# Altium project UP24CI01v5.PrjPcb
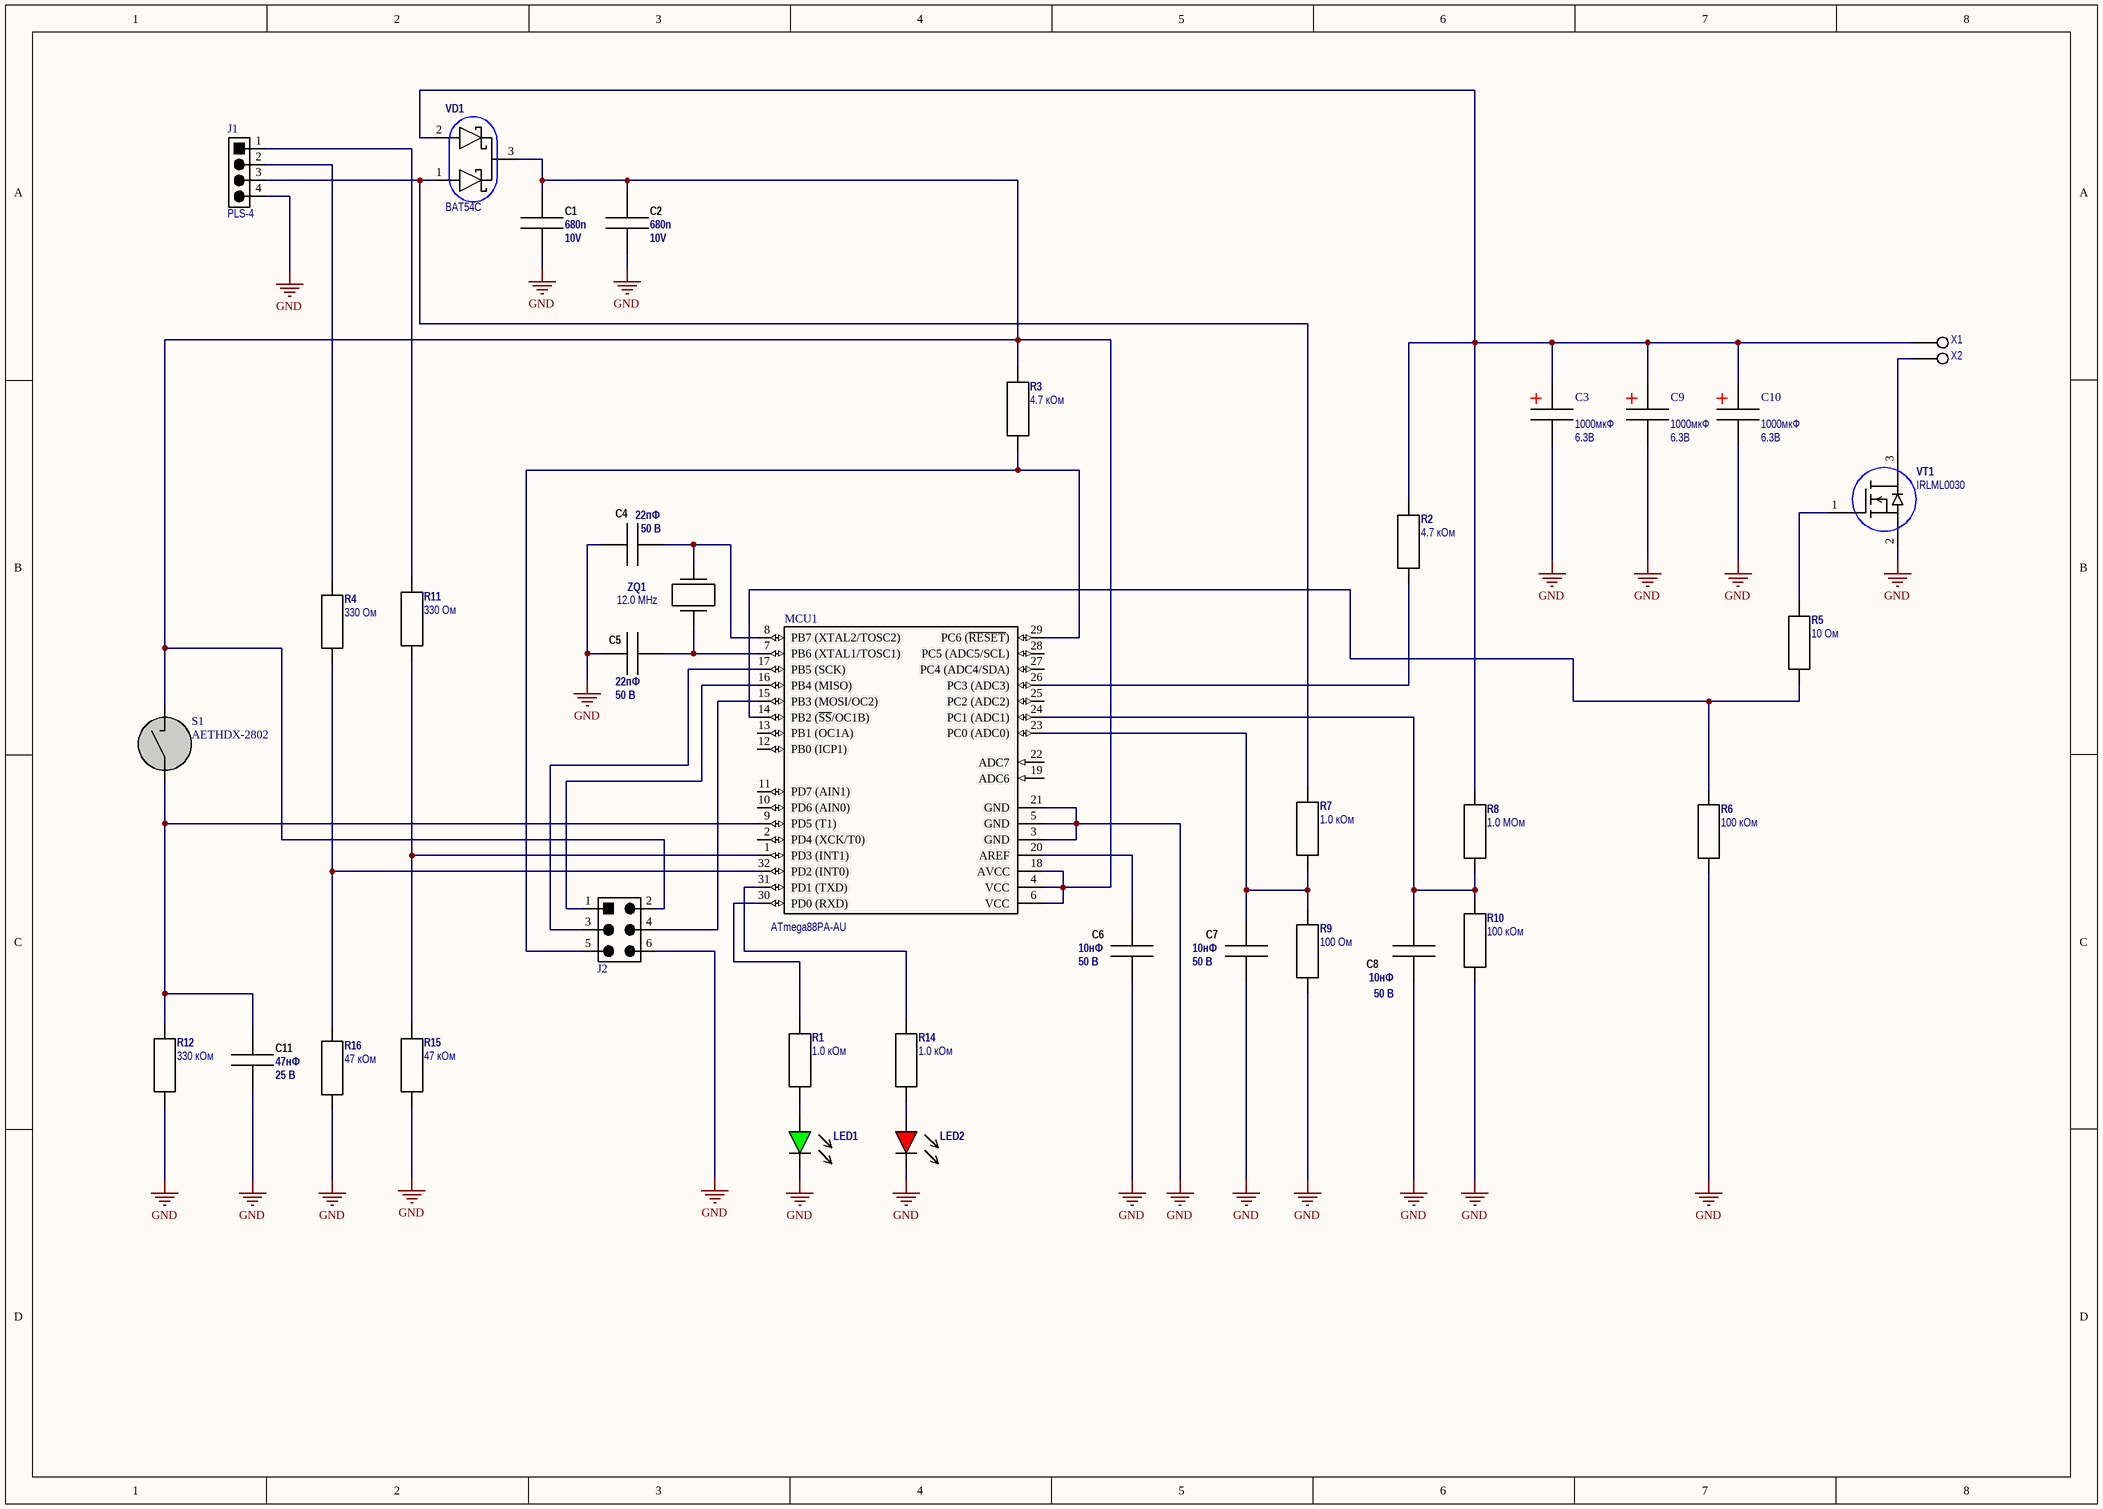
[diagram p0: MCU.SchDoc]
1 sheet, 37 parts. Net scope: global (net labels, ports and power ports of the same name join across sheets).
Board file: UP24CI01v5.PcbDoc

## Sheet MCU.SchDoc
size A3

### Parts
C1  showvalue: 680n  VOLTAGE: 10V  [C0603]  (hidden comment: 680нФ 10 В 10% 0603 X7R)
C2  showvalue: 680n  VOLTAGE: 10V  [C0603]  (hidden comment: 680нФ 10 В 10% 0603 X7R)
C3  value 1000мкФ  VOLTAGE: 6.3В  [ELCAP_SMD_8x10.5]  (hidden comment: 1000мкФ 6.3В 8x10.5)
C4  showvalue: 22пФ  VOLTAGE: 50 В  [C0603]  (hidden comment: 22пФ  5%  50В 0603 NPO)
C5  showvalue: 22пФ  VOLTAGE: 50 В  [C0603]  (hidden comment: 22пФ  5%  50В 0603 NPO)
C6  showvalue: 10нФ  VOLTAGE: 50 В  [C0603]  (hidden comment: 10нФ 50 В 10% 0603 X7R)
C7  showvalue: 10нФ  VOLTAGE: 50 В  [C0603]  (hidden comment: 10нФ 50 В 10% 0603 X7R)
C8  showvalue: 10нФ  VOLTAGE: 50 В  [C0603]  (hidden comment: 10нФ 50 В 10% 0603 X7R)
C9  value 1000мкФ  VOLTAGE: 6.3В  [ELCAP_SMD_8x10.5]  (hidden comment: 1000мкФ 6.3В 8x10.5)
C10  value 1000мкФ  VOLTAGE: 6.3В  [ELCAP_SMD_8x10.5]  (hidden comment: 1000мкФ 6.3В 8x10.5)
C11  showvalue: 47нФ  VOLTAGE: 25 В  [C0603]  (hidden comment: 47нФ 25 В 10% 0603 X7R)
J1  PLS-4  [HEADER 1X4]
J2  PLD-6  [HEADER 2X3]  (value not drawn)
LED1  (no value)  [LED0805G]
LED2  (no value)  [LED0805R]
MCU1  ATmega88PA-AU  [LQFP-32-P0.8]
R1  showvalue: 1.0 кОм  [R0603]  (hidden comment: 1.0 кОм 0603 5%)
R2  showvalue: 4.7 кОм  [R0603]  (hidden comment: 4.7 кОм 0603 5%)
R3  showvalue: 4.7 кОм  [R0603]  (hidden comment: 4.7 кОм 0603 5%)
R4  showvalue: 330 Ом  [R0603]  (hidden comment: 330 Ом 0603 5%)
R5  showvalue: 10 Ом  [R0603]  (hidden comment: 10 Ом 0603 5%)
R6  showvalue: 100 кОм  [R0603]  (hidden comment: 100 кОм 0603 5%)
R7  showvalue: 1.0 кОм  [R0603]  (hidden comment: 1.0 кОм 0603 5%)
R8  showvalue: 1.0 МОм  [R0603]  (hidden comment: 1.0 МОм 0603 5%)
R9  showvalue: 100 Ом  [R0603]  (hidden comment: 100 Ом 0603 5%)
R10  showvalue: 100 кОм  [R0603]  (hidden comment: 100 кОм 0603 5%)
R11  showvalue: 330 Ом  [R0603]  (hidden comment: 330 Ом 0603 5%)
R12  showvalue: 330 кОм  [R0603]  (hidden comment: 330 кОм 0603 5%)
R14  showvalue: 1.0 кОм  [R0603]  (hidden comment: 1.0 кОм 0603 5%)
R15  showvalue: 47 кОм  [R0603]  (hidden comment: 47 кОм 0603 5%)
R16  showvalue: 47 кОм  [R0603]  (hidden comment: 47 кОм 0603 5%)
S1  AETHDX-2802  [AETHDX-2802]
VD1  BAT54C  [SOT-23]
VT1  IRLML0030  [SOT-23]
X1  Wire_075  [wire_075]  (value not drawn)
X2  Wire_075  [wire_075]  (value not drawn)
ZQ1  value 12.0 MHz  [HC-49S]  (hidden comment: 12.0 MHz HC-49S)

### Nets
GND: C1.2 C2.2 C3.2 C4.1 C5.1 C6.2 C7.2 C8.2 C9.2 C10.2 C11.2 J1.4 J2.6 LED1.K LED2.K MCU1.3(GND) MCU1.5(GND) MCU1.21(GND) R6.2 R9.1 R10.1 R12.1 R15.1 R16.1 VT1.2(S)
NetC1_1: C1.1 C2.1 J2.2 MCU1.4(VCC) MCU1.6(VCC) MCU1.18(AVCC) R3.2 S1.1 VD1.3
NetC3_1: C3.1 C9.1 C10.1 R2.2 R8.2 VD1.2 X1.1
NetC4_2: C4.2 MCU1.8(PB7_(XTAL2/TOSC2)) ZQ1.2
NetC5_2: C5.2 MCU1.7(PB6_(XTAL1/TOSC1)) ZQ1.1
NetC6_1: C6.1 MCU1.20(AREF)
NetC7_1: C7.1 MCU1.23(PC0_(ADC0)) R7.1 R9.2
NetC8_1: C8.1 MCU1.24(PC1_(ADC1)) R8.1 R10.2
NetC11_1: C11.1 MCU1.9(PD5_(T1)) R12.2 S1.0
NetJ1_1: J1.1 R11.2
NetJ1_2: J1.2 R4.2
NetJ1_3: J1.3 R7.2 VD1.1
NetJ2_1: J2.1 MCU1.16(PB4_(MISO))
NetJ2_3: J2.3 MCU1.17(PB5_(SCK))
NetJ2_4: J2.4 MCU1.15(PB3_(MOSI/OC2))
NetJ2_5: J2.5 MCU1.29(PC6_(~{RESET})) R3.1
NetLED1_A: LED1.A R1.1
NetLED2_A: LED2.A R14.1
NetMCU1_1: MCU1.1(PD3_(INT1)) R11.1 R15.2
NetMCU1_14: MCU1.14(PB2_(~{SS}/OC1B)) R5.2 R6.1
NetMCU1_26: MCU1.26(PC3_(ADC3)) R2.1
NetMCU1_30: MCU1.30(PD0_(RXD)) R1.2
NetMCU1_31: MCU1.31(PD1_(TXD)) R14.2
NetMCU1_32: MCU1.32(PD2_(INT0)) R4.1 R16.2
NetR5_1: R5.1 VT1.1(G)
NetVT1_3: VT1.3(D) X2.1

Not connected (* = marked no-connect by the designer): MCU1 2(PD4_(XCK/T0)) 10(PD6_(AIN0)) 11(PD7_(AIN1)) 12(PB0_(ICP1)) 13(PB1_(OC1A)) 19(ADC6) 22(ADC7) 25(PC2_(ADC2)) 27(PC4_(ADC4/SDA)) 28(PC5_(ADC5/SCL))

### Library data of the parts
C1 C2 = 47нФ 25 В: конденсатор керамический SMD; value: 680n; Designator: capacitor; Component Kind: Standard; Component Type: Standard; Library Reference: capacitor; Pin Count: 2; HelpURL: d:\doc\datasheets\-COMPONENTS\Capacitors\YAGEO\Yageo_CC_cercaps.pdf
  C1: Part Number: 680нФ 10В
  C2: Part Number: 680нФ 10 В
C3 C9 C10 = 1000мкФ 6.3В 8x10.5: конденсатор электролитический SMD; Library Reference: CAP; Part Number: 1000мкФ 6.3В 8x10.5; Component Kind: Standard; Component Type: Standard; Pin Count: 2
C4 C5 = 22пФ  50В: конденсатор керамический; articul: 932; value: 22p; Designator: capacitor; Part Number: 22пФ  50В; Component Kind: Standard; Component Type: Standard; Library Reference: capacitor; Pin Count: 2; HelpURL: d:\doc\datasheets\-COMPONENTS\Capacitors\AVX\NPO.pdf
C6-C8 = 10нФ 50 В: конденсатор керамический SMD; articul: 946; value: 10n; Designator: capacitor; Part Number: 10нФ 50 В; Component Kind: Standard; Component Type: Standard; Library Reference: capacitor; Pin Count: 2; HelpURL: d:\doc\datasheets\-COMPONENTS\Capacitors\YAGEO\Yageo_CC_cercaps.pdf
C11 = 47нФ 25 В: конденсатор керамический SMD; value: 47n; Designator: capacitor; Part Number: 47нФ 25 В; Component Kind: Standard; Component Type: Standard; Library Reference: capacitor; Pin Count: 2; HelpURL: d:\doc\datasheets\-COMPONENTS\Capacitors\YAGEO\Yageo_CC_cercaps.pdf
J1 = PLS-4: Штырьки на плату шаг 2,54 мм; articul: 225; slice: 0.1; NAME: PLS-4
J2 = PLD-6: articul: 226; slice: 0.075
LED1 = GB-SM0805UPGW-TR: зеленый светодиод; Vf: 3.3V; articul: 829
LED2 = GB-SM0805USW-TR: красный светодиод; Vf: 1.9V
MCU1 = ATmega8A-AU: 8-bit AVR Microcontroller, 8KB Flash, 512 Bytes EEPROM, 1KB SRAM, 32-pin TQFP, Industrial Grade (-40°C to 85°C); HeplURL: d:\doc\datasheets\A\AT\ATmega\atmega8a.pdf; NAME: ATmega88PA-AU
R1 R7 R14 = 1.0 кОм 0603 5%: резистор постоянный; articul: 720; VALUE: 1.0k; Part Number: 1.0 кОм 0603 5%; Component Kind: Standard; Component Type: Standard; Designator: 1.0 кОм 0603 5%; Pin Count: 2; HelpURL: d:\doc\datasheets\-COMPONENTS\Resistors\Royal Ohm\general.pdf
R2 R3 = 4.7 кОм 0603 5%: резистор постоянный; articul: 1195; VALUE: 4.7k; Part Number: 4.7 кОм 0603 5%; Component Kind: Standard; Component Type: Standard; Designator: 4.7 кОм 0603 5%; Pin Count: 2; HelpURL: d:\doc\datasheets\-COMPONENTS\Resistors\Royal Ohm\general.pdf
R4 R11 = 330 Ом 0603 5%: резистор постоянный; articul: 2049; VALUE: 330; Part Number: 330 Ом 0603 5%; Component Kind: Standard; Component Type: Standard; Designator: 330 Ом 0603 5%; Pin Count: 2; HelpURL: d:\doc\datasheets\-COMPONENTS\Resistors\Royal Ohm\general.pdf
R5 = 10 Ом 0603 5%: резистор постоянный; articul: 0; VALUE: 10; Part Number: 10 Ом 0603 5%; Component Kind: Standard; Component Type: Standard; Designator: 10 Ом 0603 5%; Pin Count: 2; HelpURL: d:\doc\datasheets\-COMPONENTS\Resistors\Royal Ohm\general.pdf
R6 R10 = 100 кОм 0603 5%: резистор постоянный; articul: 919; VALUE: 100k; Part Number: 100 кОм 0603 5%; Component Kind: Standard; Component Type: Standard; Designator: 100 кОм 0603 5%; Pin Count: 2; HelpURL: d:\doc\datasheets\-COMPONENTS\Resistors\Royal Ohm\general.pdf
R8 = 1.0 МОм 0603 5%: резистор постоянный; articul: 2052; VALUE: 1.0Meg; Part Number: 1.0 МОм 0603 5%; Component Kind: Standard; Component Type: Standard; Designator: 1.0 МОм 0603 5%; Pin Count: 2; HelpURL: d:\doc\datasheets\-COMPONENTS\Resistors\Royal Ohm\general.pdf
R9 = 100 Ом 0603 5%: резистор постоянный; articul: 2671; VALUE: 100; Part Number: 100 Ом 0603 5%; Component Kind: Standard; Component Type: Standard; Designator: 100 Ом 0603 5%; Pin Count: 2; HelpURL: d:\doc\datasheets\-COMPONENTS\Resistors\Royal Ohm\general.pdf
R12 = 330 кОм 0603 5%: резистор постоянный; articul: 0; VALUE: 330k; Part Number: 330 кОм 0603 5%; Component Kind: Standard; Component Type: Standard; Designator: 330 кОм 0603 5%; Pin Count: 2; HelpURL: d:\doc\datasheets\-COMPONENTS\Resistors\Royal Ohm\general.pdf
R15 R16 = 47 кОм 0603 5%: резистор постоянный; articul: 920; VALUE: 47k; Part Number: 47 кОм 0603 5%; Component Kind: Standard; Component Type: Standard; Designator: 47 кОм 0603 5%; Pin Count: 2; HelpURL: d:\doc\datasheets\-COMPONENTS\Resistors\Royal Ohm\general.pdf
S1 = AETHDX-2802: Shock sensor AETHDX-2802
VD1 = BAT54C: два диода Шоттки; articul: 524; HelpURL: d:\doc\datasheets\B\BA\BAT54_SER.pdf; NAME: BAT54C
VT1 = IRLML2060TRPBF: N-channel MOSFET; articul: 619; NAME: IRLML0030
X1 X2 = Wire_075: Посадочное место под 0,75 кабель
ZQ1 = 12.0 MHz HC-49S: Кварцевый резонатор; NAME: 12.0 MHz HC-49S; HelpURL: d:\doc\datasheets\-COMPONENTS\Crystal\GEYER-KX-49-V1_01.pdf